# EAGLE schematic 23128_ROM-el_v1.1 (EAGLE 7.7.0)
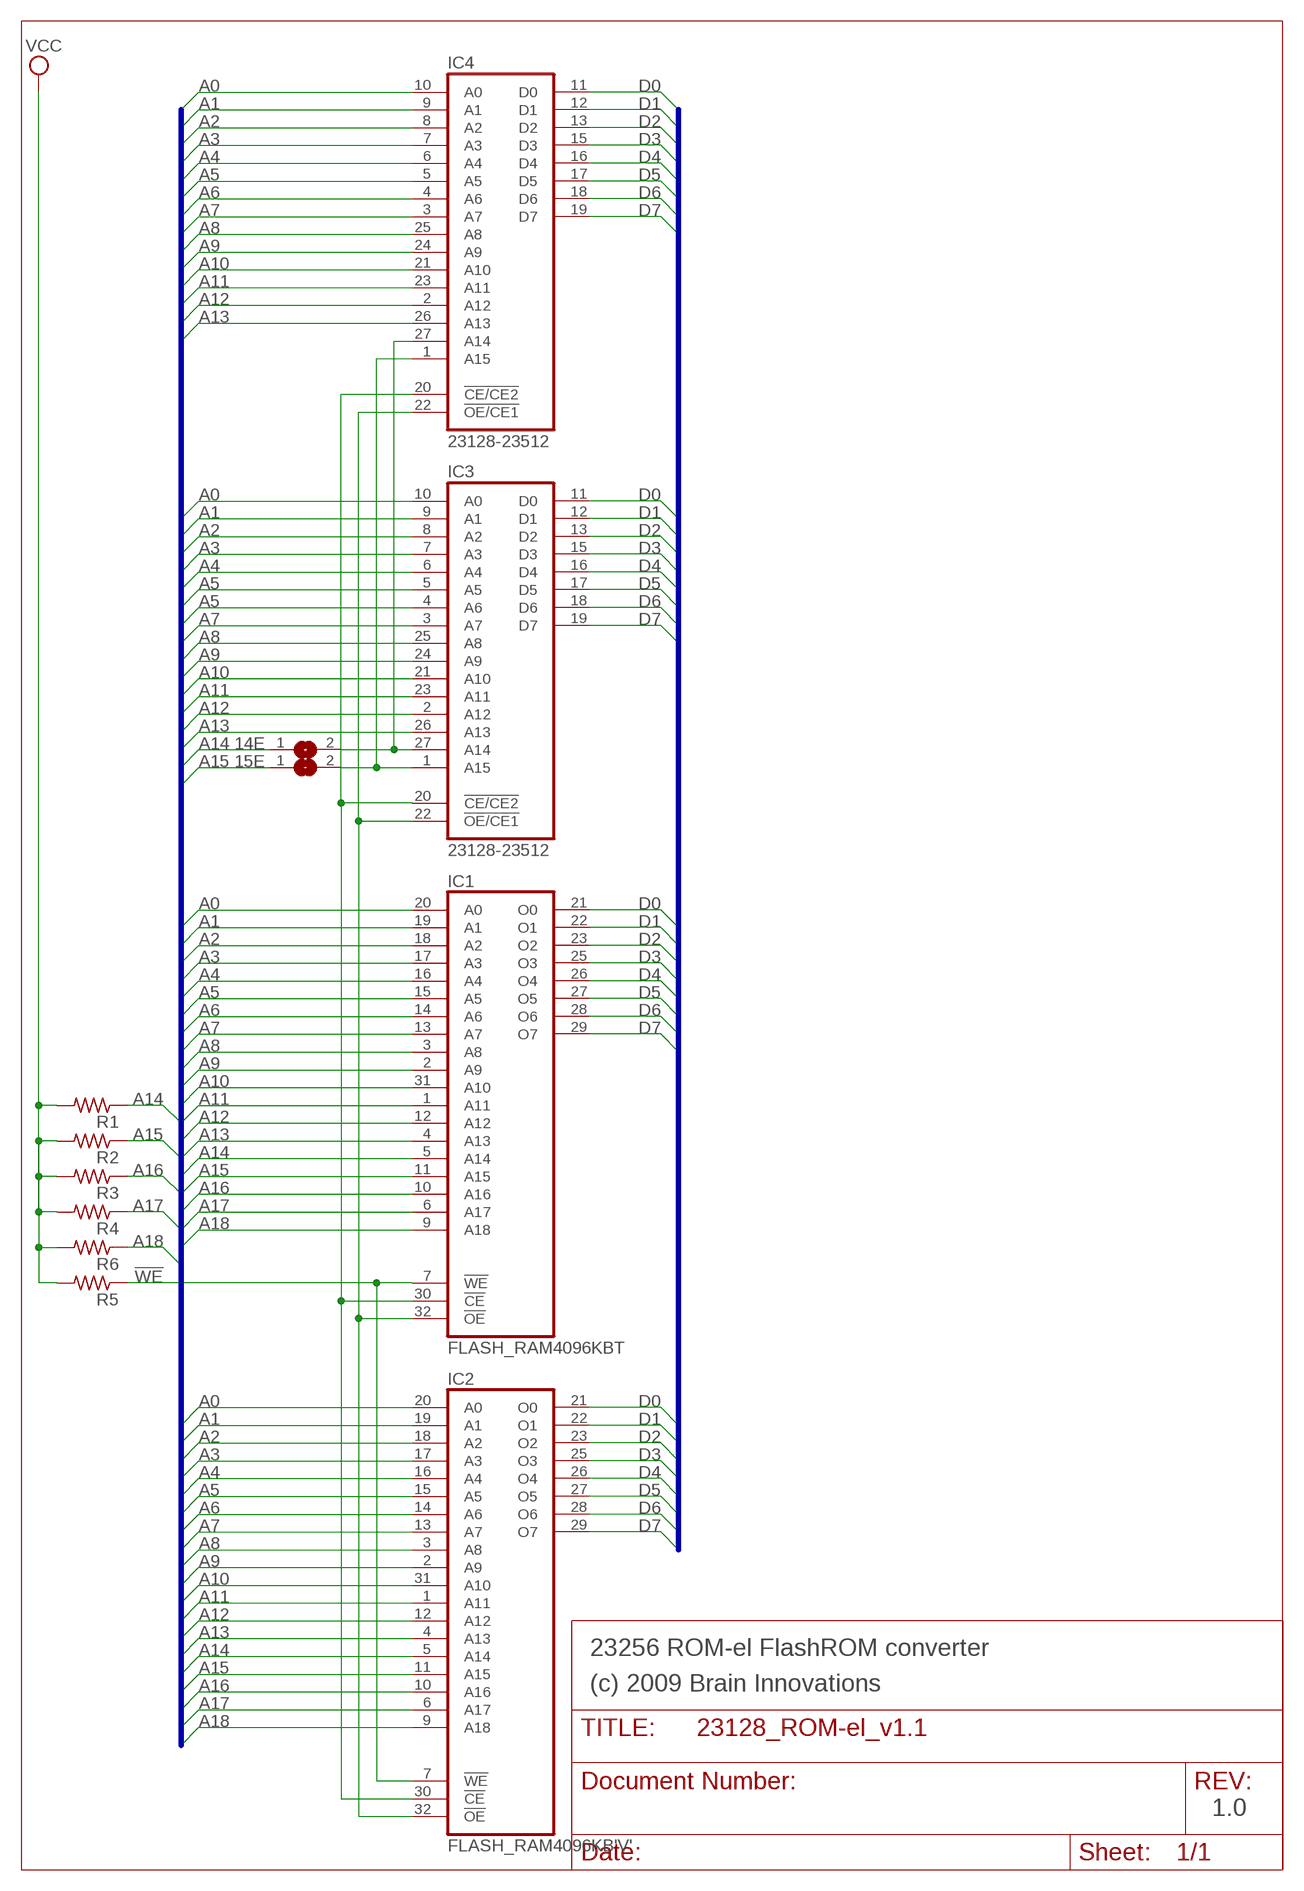
[diagram p0: schematic, sheet 1]

## Parts
14E  SJ  [SJ]
15E  15E  SJ  [SJ]
IC1  FLASH_RAM4096KBT  FLASH_RAM4096KB'T'  [TSOP32]
IC2  FLASH_RAM4096KB'V'  [VSOP32]
IC3  23128-23512  23512-RP  [DIL28-ROUNDPAD]
IC4  23128-23512  23512-SB  [DIL28-SMD-REVERSE]
R1  R-US_R0805  [R0805]
R2  R-US_R0805  [R0805]
R3  R-US_R0805  [R0805]
R4  R-US_R0805  [R0805]
R5  R-US_R0805  [R0805]
R6  R-US_R0805  [R0805]

## Nets
!WE: IC1.7(!WE) IC2.7(!WE) R5.1
A0: IC1.20(A0) IC2.20(A0) IC3.10(A0) IC4.10(A0)
A1: IC1.19(A1) IC2.19(A1) IC3.9(A1) IC4.9(A1)
A2: IC1.18(A2) IC2.18(A2) IC3.8(A2) IC4.8(A2)
A3: IC1.17(A3) IC2.17(A3) IC3.7(A3) IC4.7(A3)
A4: IC1.16(A4) IC2.16(A4) IC3.6(A4) IC4.6(A4)
A5: IC1.15(A5) IC2.15(A5) IC3.5(A5) IC4.5(A5)
A6: IC1.14(A6) IC2.14(A6) IC3.4(A6) IC4.4(A6)
A7: IC1.13(A7) IC2.13(A7) IC3.3(A7) IC4.3(A7)
A8: IC1.3(A8) IC2.3(A8) IC3.25(A8) IC4.25(A8)
A9: IC1.2(A9) IC2.2(A9) IC3.24(A9) IC4.24(A9)
A10: IC1.31(A10) IC2.31(A10) IC3.21(A10) IC4.21(A10)
A11: IC1.1(A11) IC2.1(A11) IC3.23(A11) IC4.23(A11)
A12: IC1.12(A12) IC2.12(A12) IC3.2(A12) IC4.2(A12)
A13: IC1.4(A13) IC2.4(A13) IC3.26(A13) IC4.26(A13)
A14: 14E.1 IC1.5(A14) IC2.5(A14) R1.1
A15: 15E.1 IC1.11(A15) IC2.11(A15) R2.1
A16: IC1.10(A16) IC2.10(A16) R3.1
A17: IC1.6(A17) IC2.6(A17) R4.1
A18: IC1.9(A18) IC2.9(A18) R6.1
D0: IC1.21(O0) IC2.21(O0) IC3.11(D0) IC4.11(D0)
D1: IC1.22(O1) IC2.22(O1) IC3.12(D1) IC4.12(D1)
D2: IC1.23(O2) IC2.23(O2) IC3.13(D2) IC4.13(D2)
D3: IC1.25(O3) IC2.25(O3) IC3.15(D3) IC4.15(D3)
D4: IC1.26(O4) IC2.26(O4) IC3.16(D4) IC4.16(D4)
D5: IC1.27(O5) IC2.27(O5) IC3.17(D5) IC4.17(D5)
D6: IC1.28(O6) IC2.28(O6) IC3.18(D6) IC4.18(D6)
D7: IC1.29(O7) IC2.29(O7) IC3.19(D7) IC4.19(D7)
N$1: IC1.32(!OE) IC2.32(!OE) IC3.22(!OE/CE1) IC4.22(!OE/CE1)
N$2: IC1.30(!CE) IC2.30(!CE) IC3.20(!CE/CE2) IC4.20(!CE/CE2)
N$3: 14E.2 IC3.27(A14) IC4.27(A14)
N$4: 15E.2 IC3.1(A15) IC4.1(A15)
VCC: R1.2 R2.2 R3.2 R4.2 R5.2 R6.2

## Buses
A[0..18]
D[0..7]

## Notes on the sheet
- 23256 ROM-el FlashROM converter
- (c) 2009 Brain Innovations
- 1.0

## Power pins joined to a net without a drawn wire
GND: IC1.24(GND) IC2.24(GND) IC3.14(GND) IC4.14(GND)
VCC: IC1.8(VCC) IC2.8(VCC) IC3.28(VCC) IC4.28(VCC)

## Library data of the parts
14E 15E = jumper:SJ: SMD solder JUMPER
IC1 IC2 = memory-jedec:FLASH_RAM4096KB
IC3 IC4 = commodore:23512: MEMORY
R1-R6 = resistor:R-US_: RESISTOR, American symbol